# EAGLE design SovietvcoV2.1 (EAGLE 9.6.2)
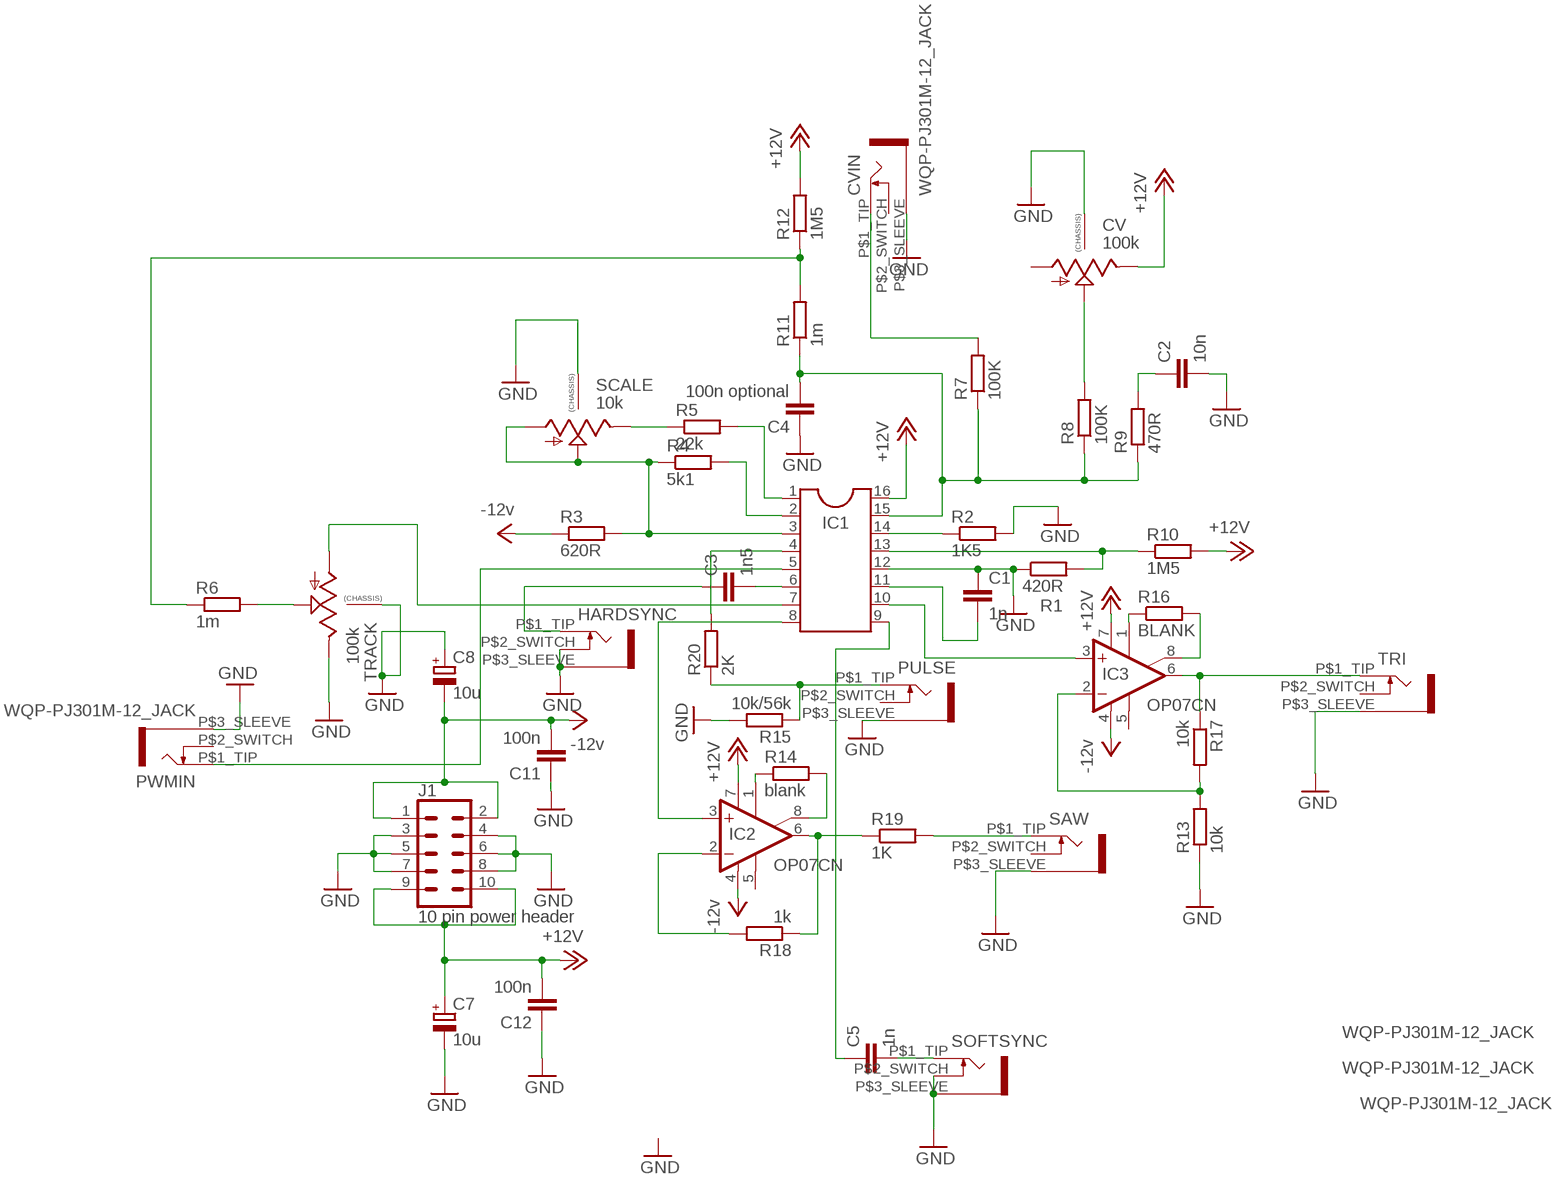
[diagram p0: schematic, sheet 1]

## Parts
C1  1n  C5/2.5  [C5B2.5]
C2  10n  C5/2.5  [C5B2.5]
C3  1n5  C5/2.5  [C5B2.5]
C4  100n optional  C5/2.5  [C5B2.5]
C5  1n  C5/2.5  [C5B2.5]
C7  10u  CPOL-EUE1.8-4  [E1,8-4]
C8  10u  CPOL-EUE1.8-4  [E1,8-4]
C11  100n  C5/2.5  [C5B2.5]
C12  100n  C5/2.5  [C5B2.5]
CV  100k  9MM_SNAP-IN_POT_CHASSIS  [9MM_SNAP-IN_POT]
CVIN  WQP-PJ301M-12_JACK  [WQP-PJ301M-12_JACK]
HARDSYNC  WQP-PJ301M-12_JACK  [WQP-PJ301M-12_JACK]
IC1  CEM3340  DIL16S  [SOCKET-16]
IC2  OP07CN  [DIL08]
IC3  OP07CN  [DIL08]
J1  10 pin power header  CONN_05X2SHD-NS  [2X5-SHROUDED-NS]
PULSE  WQP-PJ301M-12_JACK  [WQP-PJ301M-12_JACK]
PWMIN  WQP-PJ301M-12_JACK  [WQP-PJ301M-12_JACK]
R1  420R  R-EU_0207/7  [0207/7]
R2  1K5  R-EU_0207/7  [0207/7]
R3  620R  R-EU_0207/7  [0207/7]
R4  5k1  R-EU_0207/7  [0207/7]
R5  22k  R-EU_0207/7  [0207/7]
R6  1m  R-EU_0207/7  [0207/7]
R7  100K  R-EU_0207/7  [0207/7]
R8  100K  R-EU_0207/7  [0207/7]
R9  470R  R-EU_0207/7  [0207/7]
R10  1M5  R-EU_0207/7  [0207/7]
R11  1m  R-EU_0207/7  [0207/7]
R12  1M5  R-EU_0207/7  [0207/7]
R13  10k  R-EU_0207/7  [0207/7]
R14  blank  R-EU_0207/7  [0207/7]
R15  10k/56k  R-EU_0207/7  [0207/7]
R16  BLANK  R-EU_0207/7  [0207/7]
R17  10k  R-EU_0207/7  [0207/7]
R18  1k  R-EU_0207/7  [0207/7]
R19  1K  R-EU_0207/7  [0207/7]
R20  2K  R-EU_0207/7  [0207/7]
SAW  WQP-PJ301M-12_JACK  [WQP-PJ301M-12_JACK]
SCALE  10k  9MM_SNAP-IN_POT_CHASSIS  [9MM_SNAP-IN_POT]
SOFTSYNC  WQP-PJ301M-12_JACK  [WQP-PJ301M-12_JACK]
TRACK  100k  9MM_SNAP-IN_POT_CHASSIS  [9MM_SNAP-IN_POT]
TRI  WQP-PJ301M-12_JACK  [WQP-PJ301M-12_JACK]

## Nets
+12V: C7.+ C12.2 CV.3(E) IC1.16 IC2.7(V+) IC3.7(V+) J1.9 J1.10 R10.2 R12.2
-5V: IC2.4(V-) IC3.4(V-) ; supply symbol labelled -12v
-12V: C8.- C11.2 J1.1 J1.2 R3.1 ; supply symbol labelled -12v
GND: C1.1 C2.2 C4.1 C7.- C8.+ C11.1 C12.1 CV.CHASSIS1 CV.CHASSIS2 CVIN.P$3_SLEEVE IC1.12 J1.3 J1.4 J1.5 J1.6 J1.7 J1.8 PULSE.P$3_SLEEVE PWMIN.P$3_SLEEVE R1.1 R2.2 R13.1 R15.2 SAW.P$3_SLEEVE SCALE.CHASSIS1 SCALE.CHASSIS2 TRACK.3(E) TRACK.CHASSIS1 TRACK.CHASSIS2 TRI.P$3_SLEEVE
N$1: R5.1 SCALE.3(E)
N$2: IC1.3 R3.2 R4.1 SCALE.1(A) SCALE.2(S)
N$3: C1.2 IC1.11
N$4: C4.2 IC1.15 R7.1 R8.1 R9.1 R11.1
N$5: IC1.13 R1.2 R10.1
N$6: IC1.14 R2.1
N$7: IC1.8 IC2.3(+IN)
N$8: IC1.2 R4.2
N$9: IC2.1(ON1) R14.1
N$10: IC1.7 TRACK.1(A)
N$11: IC1.1 R5.2
N$12: IC3.6(OUT) R17.1 TRI.P$1_TIP
N$13: R6.2 TRACK.2(S)
N$14: CVIN.P$1_TIP R7.2
N$15: IC3.2(-IN) R13.2 R17.2
N$16: R6.1 R11.2 R12.1
N$17: SOFTSYNC.P$2_SWITCH
N$18: PULSE.P$1_TIP R15.1 R20.1
N$19: C5.1 IC1.9
N$20: IC2.6(OUT) R18.1 R19.1
N$21: C5.2 SOFTSYNC.P$1_TIP
N$22: HARDSYNC.P$2_SWITCH HARDSYNC.P$3_SLEEVE SOFTSYNC.P$3_SLEEVE ; supply symbol labelled GND
N$23: IC2.8(ON2) R14.2
N$24: IC3.1(ON1) R16.1
N$25: C2.1 R9.2
N$26: CV.2(S) R8.2
N$27: IC3.8(ON2) R16.2
N$28: C3.2 IC1.6
N$29: R19.2 SAW.P$1_TIP
N$30: IC2.2(-IN) R18.2
N$31: C3.1 HARDSYNC.P$1_TIP
N$32: IC1.10 IC3.3(+IN)
N$33: IC1.4 R20.2
N$35: IC1.5 PWMIN.P$1_TIP
Unconnected: CV.1(A) CVIN.P$2_SWITCH IC2.5(OPT) IC3.5(OPT) PULSE.P$2_SWITCH PWMIN.P$2_SWITCH SAW.P$2_SWITCH TRI.P$2_SWITCH

## Library data of the parts
C1-C5 C11 C12 = hexcapacitor-wima:C: CAPACITOR naming: grid - package width
C7 C8 = hexresistor:CPOL-EU: POLARIZED CAPACITOR, European symbol; SPICEPREFIX: C
CV SCALE TRACK = MusicThingModular:9MM_SNAP-IN_POT_CHASSIS: 9mm vertical snap-in pot, Alpha / Panasonic style, with a connection to the metal chassis for grounding
CVIN HARDSYNC PULSE PWMIN SAW SOFTSYNC TRI = MusicThingModular:WQP-PJ301M-12_JACK
IC1 = ic-package:DIL16: Dual In Line / Socket
IC2 IC3 = linear:OP07*: OP AMP
J1 = SparkFun-Connectors:CONN_05X2: Multi connection point. Often used as Generic Header-pin footprint for 0.1 inch spaced/style header connections For AVR SPI programming port, see special device with nice symbol: "AVR_SPI_PROG_5x2.dev" You can populate with any combo of single row headers, but if you'd like an exact match, check these: 2x5 AVR ICSP Male Header <https://www.sparkfun.com/products/778> (PRT-00778) 2x5 Pin Shrouded Header <https://www.sparkfun.com/products/8506> (PRT-08506) On any of the 0.1 inch spaced packages, you can populate with these: Break Away Headers - Straight <https://www.sparkfun.com/products/116> (PRT-00116) Break Away Male Headers - Right Angle <https://www.sparkfun.com/products/553> (PRT-00553) Female Headers <https://www.sparkfun.com/products/115> (PRT-00115) Break Away Headers - Machine Pin <https://www.sparkfun.com/products/117> (PRT-00117) Break Away Female Headers - Swiss Machine Pin <https://www.sparkfun.com/products/743> (PRT-00743) Special note: the shrouded connector mates well with our 5x2 ribbon cables: 2x5 Pin IDC Ribbon Cable <https://www.sparkfun.com/products/8535> (PRT-08535); PROD_ID: CONN-08671; SF_ID: PRT-08506
R1-R13 R15 R17 R18 = hexresistor:R-EU_: RESISTOR, European symbol; SPICEPREFIX: R
R14 R16 R19 R20 = hexxxxrcl:R-EU_: RESISTOR, European symbol; SPICEPREFIX: R

## Net classes
0 default: width 0.457 mm

## Board
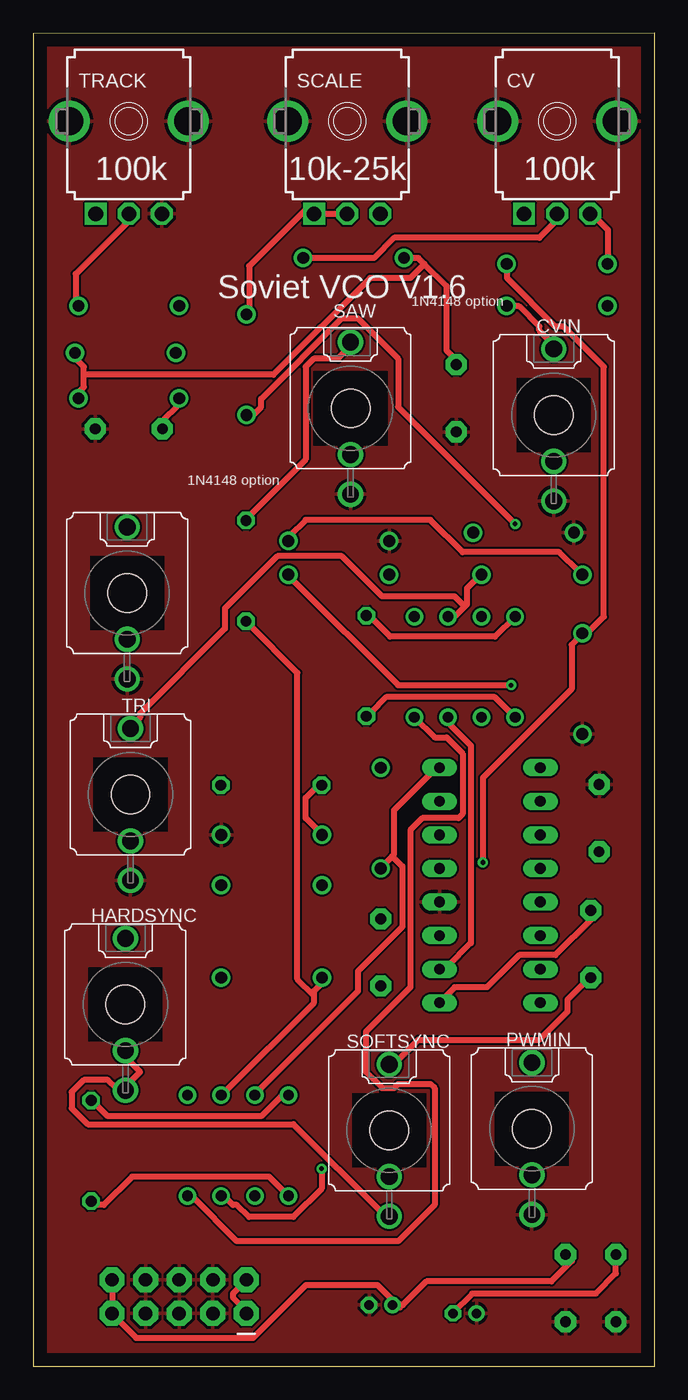
[diagram p1: board, top side]
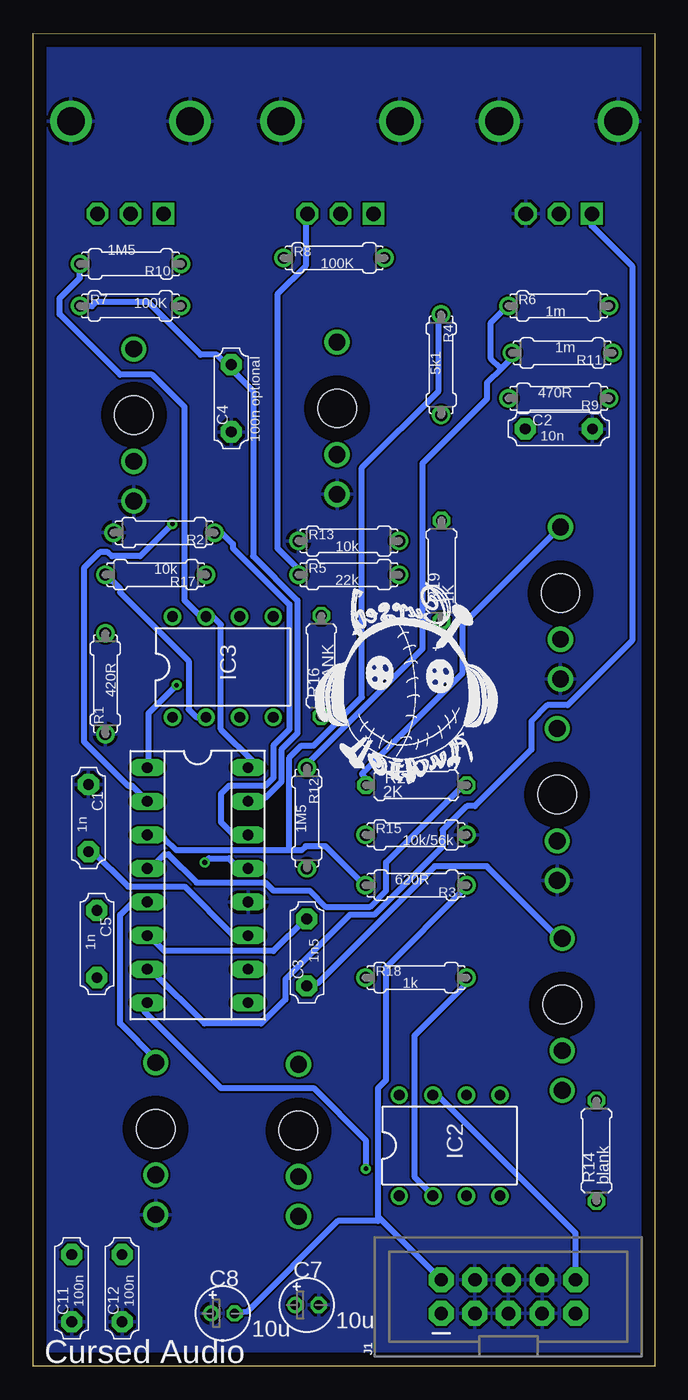
[diagram p2: board, bottom side, seen from below]

Size 46.99 x 100.85 mm. Coordinates in mm from the lower left corner, seen from the top.
Outline: 0,0.03 46.99,0 46.99,100.85 0,100.8 0,0.03
Copper layers (1*16): Top 0.035mm / dielectric 1.5mm / Bottom 0.035mm
Design rules "default": minimum track width 6mil, minimum drill 0.35mm, track to track 6mil, track to pad 6mil, pad to pad 6mil, via to via 6mil, smd to smd 6mil, copper to edge 40mil, drill to drill 6mil, minimum pad ring 10mil, minimum via ring 8mil, stop-mask expansion 4mil, vias tented up to drill 0mil, thermal gap 10mil

### Footprints (pad centres in the part's own frame; a part is rotated, then mirrored left to right if it is on the bottom)
C5B2.5 = drill 0.813 pad 1.6 octagon: 1 -2.54,0; 2 2.54,0
E1,8-4 = drill 0.711 pad 1.168: + -0.889,0 | drill 0.711 pad 1.168 octagon: - 0.889,0
9MM_SNAP-IN_POT = drill 1.1 square: 1 -2.5,-7 | drill 1.1 octagon: 2 0,-7; 3 2.5,-7 | drill 2.1 pad 2.794: CHASSIS1 -4.5,0; CHASSIS2 4.5,0
WQP-PJ301M-12_JACK = drill 1.27 pad 1.651: P$1_TIP 0,5; P$2_SWITCH 0,-3.5; P$3_SLEEVE 0,-6.5 | hole 2.921: 0,0
SOCKET-16 = drill 0.813 long: 1 -8.89,-3.81; 2 -6.35,-3.81; 3 -3.81,-3.81; 4 -1.27,-3.81; 5 1.27,-3.81; 6 3.81,-3.81; 7 6.35,-3.81; 8 8.89,-3.81; 9 8.89,3.81; 10 6.35,3.81; 11 3.81,3.81; 12 1.27,3.81; 13 -1.27,3.81; 14 -3.81,3.81; 15 -6.35,3.81; 16 -8.89,3.81
DIL08 = drill 0.813 pad 1.27: 1 -3.81,-3.81; 2 -1.27,-3.81; 3 1.27,-3.81; 4 3.81,-3.81; 5 3.81,3.81; 6 1.27,3.81; 7 -1.27,3.81; 8 -3.81,3.81
2X5-SHROUDED-NS = drill 1.016 pad 1.88 octagon: 1 -1.27,5.08; 2 1.27,5.08; 3 -1.27,2.54; 4 1.27,2.54; 5 -1.27,0; 6 1.27,0; 7 -1.27,-2.54; 8 1.27,-2.54; 9 -1.27,-5.08; 10 1.27,-5.08
0207/7 = drill 0.889: 1 -3.81,0; 2 3.81,0
0207/7' = drill 0.813 octagon: 1 -3.81,0; 2 3.81,0

### Placement (x,y rotation side)
C1  42.8,41.48 270 bottom
C2  7.24,70.92 0 bottom
C3  26.29,31.32 90 bottom
C4  32,73.23 90 bottom
C5  42.16,31.95 270 bottom
C7  26.29,4.65 0 bottom
C8  32.64,4.01 0 bottom
C11  44.07,5.92 90 bottom
C12  40.26,5.92 90 bottom
CV  39.62,94.18 0 top
CVIN  39.37,71.96 0 top
HARDSYNC  6.98,27.38 0 top
IC1  34.54,36.4 270 bottom
IC2  15.49,16.71 0 bottom
IC3  32.64,52.91 0 bottom
J1  11.05,5.28 90 bottom
PULSE  7.11,58.5 0 top
PWMIN  37.72,17.98 0 top
R1  41.53,51.64 90 bottom
R2  37.08,63.07 180 bottom
R3  18.03,36.4 180 bottom
R4  16.13,75.77 270 bottom
R5  23.11,59.89 0 bottom
R6  7.24,80.21 0 bottom
R7  39.62,80.21 0 bottom
R8  24.23,83.85 0 bottom
R9  7.24,73.23 180 bottom
R10  39.62,83.39 180 bottom
R11  6.98,76.66 180 bottom
R12  26.29,41.48 270 bottom
R13  23.11,62.43 0 bottom
R14  blank  [0207/7']  4.39,16.31 90 bottom
R15  18.03,40.21 0 bottom
R16  BLANK  [0207/7']  25.2,52.98 90 bottom
R17  37.72,59.89 180 bottom
R18  18.03,29.41 0 bottom
R19  1K  [0207/7']  16.1,60.17 90 bottom
R20  2K  [0207/7']  18.01,43.97 0 bottom
SAW  24,72.47 0 top
SCALE  23.75,94.18 0 top
SOFTSYNC  26.92,17.86 0 top
TRACK  7.24,94.18 0 top
TRI  7.37,43.26 0 top
U$1  [CA]  22.99,48.97 0 top

### Tracks (layer width: path | path; a pad name or v marks a point on that pad's centre or on a via)
+12V
  Top 0.457: C7.+ 27.96,4.65 29.74,6.43 39.19,6.43 40.74,7.98 C12.2 | J1.10 J1.9 5.97,3.99 7.8,2.16 16.64,2.16 20.65,6.17 26.04,6.17 27.76,4.45 | R10.2 43.46,83.54 43.46,85.98 42.24,87.2 CV.3 | 27.15,38.58 26.7,38.13 26.39,38.13 26.09,37.82 R12.2 | 27.15,38.58 27.3,38.74 27.3,42.09 30.35,45.14 30.66,45.14 IC1.16 | 27.15,38.58 27.91,37.82 27.91,33.25 24.56,29.9 24.56,28.37 16.94,20.75 IC2.7
  Bottom 0.457: J1.10 5.97,10.08 16.33,20.45 16.64,20.45 IC2.7 | IC1.16 30.66,45.14 30.35,45.44 30.35,45.75 32.79,48.18 32.79,56.11 33.4,56.72 IC3.7 34.31,56.72 35.53,57.94 35.53,72.57 37.97,75.01 40.41,75.01 44.98,79.58 44.98,80.8 43.46,82.32 43.46,83.24 R10.2
-5V
  Top 0.457: IC3.4 30.35,47.57 31.27,47.57 32.49,46.36 32.49,41.78 32.18,41.48 29.44,41.48 28.52,40.56 28.52,28.68 25.17,25.32 25.17,22.28 26.39,21.06 27.3,21.06 27.61,21.36 30.05,21.36 30.35,21.06 30.35,12.22 27.61,9.47 15.42,9.47 12.06,12.83 11.76,12.83 IC2.4
-12V
  Top 0.457: C8.- 31.75,4.06 33.2,5.51 42.54,5.51 44.07,7.04 C11.2 | J1.1 16.03,4.29 15.11,5.21 15.11,5.51 16.03,6.43 J1.2
  Bottom 0.457: 20.75,11.15 16.33,6.73 J1.2 | 20.75,11.15 20.9,11.3 20.9,21.06 20.3,21.67 20.3,30.2 14.5,35.99 14.5,36.3 R3.1 | C8.- 30.8,4.15 23.95,11 20.9,11 20.75,11.15
GND
  pour Top: -5.46,102.44 -5.46,-1.7 -4.19,-2.97 50.42,-2.97 51.69,-1.7 51.69,101.17 50.42,102.44
  pour Bottom: -4.19,106.25 46.61,106.25 58.04,94.82 58.04,5.92 44.07,-8.05 -6.73,-8.05 -8,-6.78 -8,102.44
N$1
  Bottom 0.457: R5.1 27,60.07 27,60.38 28.52,61.9 28.52,81.1 26.39,83.24 26.39,86.89 SCALE.3
N$2
  Top 0.457: R4.1 16.33,79.58 16.33,83.24 20.6,87.5 20.9,87.5 21.21,87.2 SCALE.1 21.51,87.2 23.65,87.2 SCALE.2
  Bottom 0.457: 27.61,39.04 26.7,39.04 26.39,39.34 24.87,39.34 22.12,36.6 R3.2 | 27.61,39.04 36.14,39.04 37.06,39.95 38.28,39.95 IC1.3 | 27.61,39.04 27.61,46.05 26.7,46.96 25.78,46.96 22.12,50.62 22.12,68 16.33,73.79 16.33,79.58 R4.1
N$3
  Bottom 0.457: IC1.11 30.96,32.64 31.88,32.64 35.53,36.3 39.8,36.3 42.54,39.04 C1.2
N$4
  Top 0.457: 3.83,75.01 3.83,74.09 3.53,73.79 3.83,73.48 3.83,73.18 3.53,73.18 R9.1 | 3.83,75.01 3.83,75.62 3.23,76.23 3.23,76.53 R11.1 | R8.1 29.13,83.85 29.59,83.39 | 29.59,83.39 31.27,81.71 31.27,76.84 32.18,75.92 C4.2 | 3.83,75.01 18.16,75.01 25.48,82.32 28.52,82.32 29.59,83.39
  Bottom 0.457: 32.18,75.62 30.35,73.79 30.35,61.29 27,57.94 27,47.88 28.22,46.66 28.22,44.22 29.44,43 30.66,43 IC1.15 | 32.18,75.62 33.1,76.53 34.31,76.53 38.28,80.49 42.24,80.49 42.54,80.19 43.15,80.19 R7.1 | 32.18,75.62 C4.2
N$5  (via drill 0.35)
  Top 0.457: v34.01,38.13 34.01,44.53 40.72,51.23 40.72,54.58 41.33,55.19 R1.2 41.63,55.19 43.15,56.72 43.15,75.62 40.11,78.66 39.5,78.66 35.84,82.32 35.84,83.24 R10.1
  Bottom 0.457: v34.01,38.13 33.71,38.43 32.18,38.43 31.57,37.82 30.96,37.82 IC1.13
N$6
  Bottom 0.457: IC1.14 30.96,40.26 31.88,40.26 32.79,41.17 32.79,43.31 32.18,43.92 29.44,43.92 28.83,44.53 28.83,46.96 27.61,48.18 27.61,57.63 31.88,61.9 31.88,62.2 33.1,63.42 33.4,63.12 R2.1
N$7  (via drill 0.35)
  Top 0.457: v21.82,14.96 21.82,13.44 19.68,11.3 16.33,11.3 15.42,12.22 15.11,12.22 14.5,12.83 IC2.3
  Bottom 0.457: v21.82,14.96 21.82,17.09 25.78,21.06 32.79,21.06 38.58,26.85 38.58,27.46 IC1.8
N$8  (via drill 0.35)
  Top 0.457: v36.45,63.73 27.61,72.57 27.61,76.23 24.56,79.27 23.34,79.27 17.25,73.18 17.25,72.57 16.33,71.65 16.03,71.96 R4.2
  Bottom 0.457: v36.45,63.73 38.89,61.29 41.02,61.29 41.33,61.6 41.93,61.6 43.15,60.38 43.15,47.27 39.8,43.92 39.5,43.92 38.58,43 IC1.2
N$9
  Top 0.457: IC2.1 17.86,14.35 7.49,14.35 5.36,12.22 4.45,12.22 R14.1
N$10
  Bottom 0.457: IC1.7 38.28,29.9 37.97,29.9 34.01,25.93 29.74,25.93 27.91,27.76 27.91,29.29 23.04,34.16 21.21,34.16 16.03,39.34 16.03,40.56 14.2,42.39 13.59,42.39 9.32,46.66 9.32,48.79 8.1,50.01 6.58,50.01 1.7,54.89 1.7,83.24 4.75,86.28 4.75,86.89 TRACK.1
N$11  (via drill 0.35)
  Top 0.457: v36.14,51.54 27.61,51.54 19.68,59.46 19.38,59.46 19.07,59.77 R5.2
  Bottom 0.457: v36.14,51.54 38.28,49.4 38.28,45.44 IC1.1
N$12
  Top 0.457: IC3.6 31.88,56.72 32.64,57.48 | 32.64,57.48 32.79,57.63 32.79,58.85 33.4,59.46 34.01,59.46 34.01,59.77 R17.1 | 32.64,57.48 31.88,58.24 26.39,58.24 23.34,61.29 18.47,61.29 14.5,57.33 14.5,55.8 8.1,49.4 8.1,49.1 7.49,48.49 TRI.P$1_TIP
N$13
  Top 0.457: R6.2 3.23,80.49 3.23,82.63 7.49,86.89 TRACK.2
N$14
  Top 0.457: R7.2 35.84,80.19 36.75,80.19 38.28,78.66 38.28,78.36 39.5,77.14 CVIN.P$1_TIP
N$15
  Top 0.457: R13.2 19.38,62.51 19.38,62.81 20.6,64.03 30.05,64.03 32.49,61.6 39.8,61.6 41.33,60.07 R17.2
  Bottom 0.457: IC3.2 34.62,49.1 35.23,49.71 35.23,53.37 40.41,58.55 40.41,58.85 41.02,59.46 41.63,59.46 41.63,59.77 R17.2
N$16
  Bottom 0.457: 11.61,75.46 10.54,76.53 R11.2 | 11.61,75.46 12.68,74.4 12.68,73.18 17.55,68.3 17.55,54.28 26.09,45.75 26.09,45.44 R12.1 | 11.61,75.46 12.37,76.23 12.37,78.97 11.15,80.19 R6.1
N$18
  Top 0.457: R20.1 21.82,43.92 21.51,43.92 20.6,43 20.6,41.48 21.51,40.56 21.82,40.56 22.12,40.26 R15.1
  Bottom 0.457: PULSE.P$1_TIP 7.19,63.42 14.5,56.11 14.5,52.45 22.12,44.83 21.51,44.22 21.82,43.92 R20.1
N$19
  Top 0.457: IC1.9 30.96,27.76 31.88,28.68 34.31,28.68 36.75,31.12 39.5,31.12 42.24,33.86 42.24,34.47 C5.1
N$20
  Top 0.457: 21.21,28.07 21.21,28.37 22.12,29.29 R18.1 | 21.21,28.07 21.21,27.46 14.5,20.75 IC2.6 | 21.21,28.07 19.99,29.29 19.99,52.45 16.33,56.11 R19.1
N$21
  Top 0.457: C5.2 41.93,29.29 40.41,27.76 40.41,26.85 38.28,24.71 29.13,24.71 27,22.58 SOFTSYNC.P$1_TIP
N$22
  Top 0.457: HARDSYNC.P$2_SWITCH 7.19,23.8 7.19,23.19 8.1,22.28 7.19,21.36 7.19,21.06 HARDSYNC.P$3_SLEEVE 6.88,21.06 6.27,21.06 5.66,21.67 3.83,21.67 2.92,20.75 2.92,19.53 4.14,18.31 19.68,18.31 26.39,11.61 26.7,11.61 SOFTSYNC.P$3_SLEEVE
N$23
  Top 0.457: R14.2 4.45,19.84 4.75,19.84 5.66,18.92 17.25,18.92 18.77,20.45 19.07,20.14 19.38,20.14 19.38,20.45 IC2.8
N$24
  Top 0.457: IC3.1 34.92,50.62 26.7,50.62 25.48,49.4 R16.1
N$25
  Top 0.457: R9.2 10.85,73.18 10.85,72.57 9.93,71.65 9.93,71.04 C2.1
N$26
  Top 0.457: R8.2 25.78,83.85 27.3,85.37 38.28,85.37 39.8,86.89 CV.2
N$27
  Top 0.457: IC3.8 34.92,55.19 27,55.19 25.48,56.72 R16.2
N$28
  Bottom 0.457: IC1.6 38.28,32.33 37.97,32.33 37.06,31.42 28.83,31.42 26.39,33.86 C3.2
N$29
  Top 0.457: R19.2 16.33,64.03 16.33,64.34 20.6,68.61 20.6,75.62 21.21,76.23 23.04,76.23 24.26,77.44 SAW.P$1_TIP
N$30
  Bottom 0.457: IC2.2 16.94,13.13 18.16,14.35 18.16,25.02 14.2,28.98 14.2,29.29 R18.2
N$31
  Bottom 0.457: C3.1 26.09,28.98 25.48,28.98 16.64,37.82 12.68,37.82 7.19,32.33 HARDSYNC.P$1_TIP
N$32
  Top 0.457: IC1.10 30.96,30.2 31.27,30.2 33.1,32.03 33.1,46.96 31.57,48.49 31.57,49.1 IC3.3
N$33
  Bottom 0.457: R20.2 14.2,43.92 14.5,43.92 20.3,38.13 20.3,35.99 21.51,34.77 24.87,34.77 26.09,35.99 28.83,35.99 29.44,36.6 34.62,36.6 36.75,38.74 37.06,38.74 38.28,37.52 IC1.4
N$35
  Bottom 0.457: IC1.5 38.58,35.08 39.5,35.08 40.41,34.16 40.41,25.93 37.67,23.19 PWMIN.P$1_TIP

### Text on the board
bPlace: Cursed Audio
tNames: 100k | 10k-25k | 100k | Soviet VCO V1.6 | 1N4148 option | 1N4148 option